# EAGLE design main_controller (EAGLE 7.6.0)
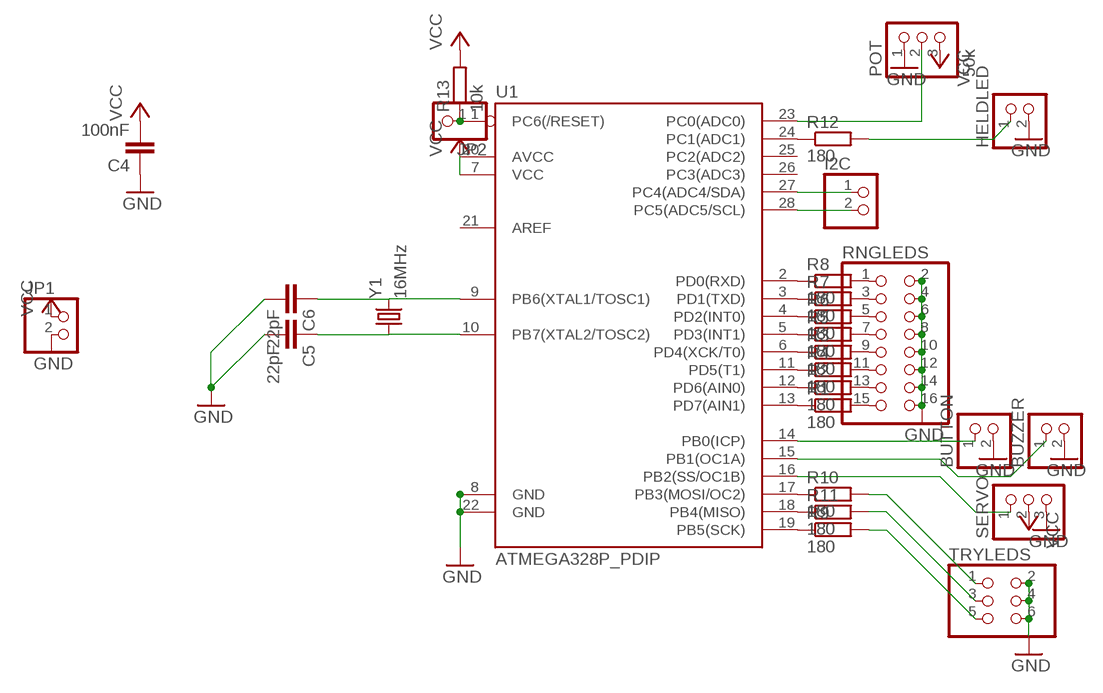
[diagram p0: schematic, sheet 1]

## Parts
BUTTON  PINHD-1X2  [1X02]
BUZZER  PINHD-1X2  [1X02]
C4  100nF  C-EU050-025X075  [C050-025X075]
C5  22pF  C-EU050-025X075  [C050-025X075]
C6  22pF  C-EU050-025X075  [C050-025X075]
HELDLED  PINHD-1X2  [1X02]
I2C  PINHD-1X2  [1X02]
JP1  PINHD-1X2  [1X02]
JP2  PINHD-1X1  [1X01]
POT  50k  PINHD-1X3  [1X03]
R1  180  R-EU_0207/7  [0207/7]
R2  180  R-EU_0207/7  [0207/7]
R3  180  R-EU_0207/7  [0207/7]
R4  180  R-EU_0207/7  [0207/7]
R5  180  R-EU_0207/7  [0207/7]
R6  180  R-EU_0207/7  [0207/7]
R7  180  R-EU_0207/7  [0207/7]
R8  180  R-EU_0207/7  [0207/7]
R9  180  R-EU_0207/7  [0207/7]
R10  180  R-EU_0207/7  [0207/7]
R11  180  R-EU_0207/7  [0207/7]
R12  180  R-EU_0207/7  [0207/7]
R13  10k  R-EU_0207/7  [0207/7]
RNGLEDS  PINHD-2X8  [2X08]
SERVO  PINHD-1X3  [1X03]
TRYLEDS  PINHD-2X3  [2X03]
U1  ATMEGA328P_PDIP  [DIL28-3]
Y1  16MHz  CRYSTALHC49US  [HC49US]

## Nets
GND: BUTTON.2 BUZZER.2 C4.1 C5.2 C6.2 HELDLED.2 JP1.2 POT.1 RNGLEDS.2 RNGLEDS.4 RNGLEDS.6 RNGLEDS.8 RNGLEDS.10 RNGLEDS.12 RNGLEDS.14 RNGLEDS.16 SERVO.3 TRYLEDS.2 TRYLEDS.4 TRYLEDS.6 U1.8(GND) U1.22(GND)
N$1: C6.1 U1.9(PB6(XTAL1/TOSC1)) Y1.2
N$2: C5.1 U1.10(PB7(XTAL2/TOSC2)) Y1.1
N$3: POT.2 U1.23(PC0(ADC0))
N$4: R12.1 U1.24(PC1(ADC1))
N$5: I2C.1 U1.27(PC4(ADC4/SDA))
N$6: I2C.2 U1.28(PC5(ADC5/SCL))
N$7: R1.1 U1.13(PD7(AIN1))
N$8: R2.1 U1.12(PD6(AIN0))
N$9: R3.1 U1.6(PD4(XCK/T0))
N$10: R4.1 U1.11(PD5(T1))
N$11: R5.1 U1.5(PD3(INT1))
N$12: R6.1 U1.4(PD2(INT0))
N$13: R7.1 U1.3(PD1(TXD))
N$14: R8.1 U1.2(PD0(RXD))
N$15: R1.2 RNGLEDS.15
N$16: R2.2 RNGLEDS.13
N$17: R3.2 RNGLEDS.9
N$18: R4.2 RNGLEDS.11
N$19: R5.2 RNGLEDS.7
N$20: R6.2 RNGLEDS.5
N$21: R7.2 RNGLEDS.3
N$22: R8.2 RNGLEDS.1
N$23: R9.1 U1.19(PB5(SCK))
N$24: R10.1 U1.17(PB3(MOSI/OC2))
N$25: R11.1 U1.18(PB4(MISO))
N$26: HELDLED.1 R12.2
N$27: R9.2 TRYLEDS.5
N$28: R11.2 TRYLEDS.3
N$29: R10.2 TRYLEDS.1
N$30: BUTTON.1 U1.14(PB0(ICP))
N$31: BUZZER.1 U1.15(PB1(OC1A))
N$32: SERVO.1 U1.16(PB2(SS/OC1B))
N$33: JP2.1 R13.1 U1.1(PC6(/RESET))
VCC: C4.2 JP1.1 POT.3 R13.2 SERVO.2 U1.7(VCC) U1.20(AVCC)
Unconnected: U1.21(AREF) U1.25(PC2(ADC2)) U1.26(PC3(ADC3))

## Library data of the parts
BUTTON BUZZER HELDLED I2C JP1 = pinhead:PINHD-1X2: PIN HEADER
C4-C6 = resistor:C-EU: CAPACITOR, European symbol
JP2 = pinhead:PINHD-1X1: PIN HEADER
POT SERVO = pinhead:PINHD-1X3: PIN HEADER
R1-R13 = resistor:R-EU_: RESISTOR, European symbol
RNGLEDS = pinhead:PINHD-2X8: PIN HEADER
TRYLEDS = pinhead:PINHD-2X3: PIN HEADER
U1 = SparkFun-DigitalIC:ATMEGA328P_PDIP: uC used in the Arduino 32kb flash, 1k EEPROM, 2k SRAM This is the through-hole version of this chip.
Y1 = SparkFun-FreqCtrl:CRYSTAL: Various standard crystals. Proven footprints.

## Board
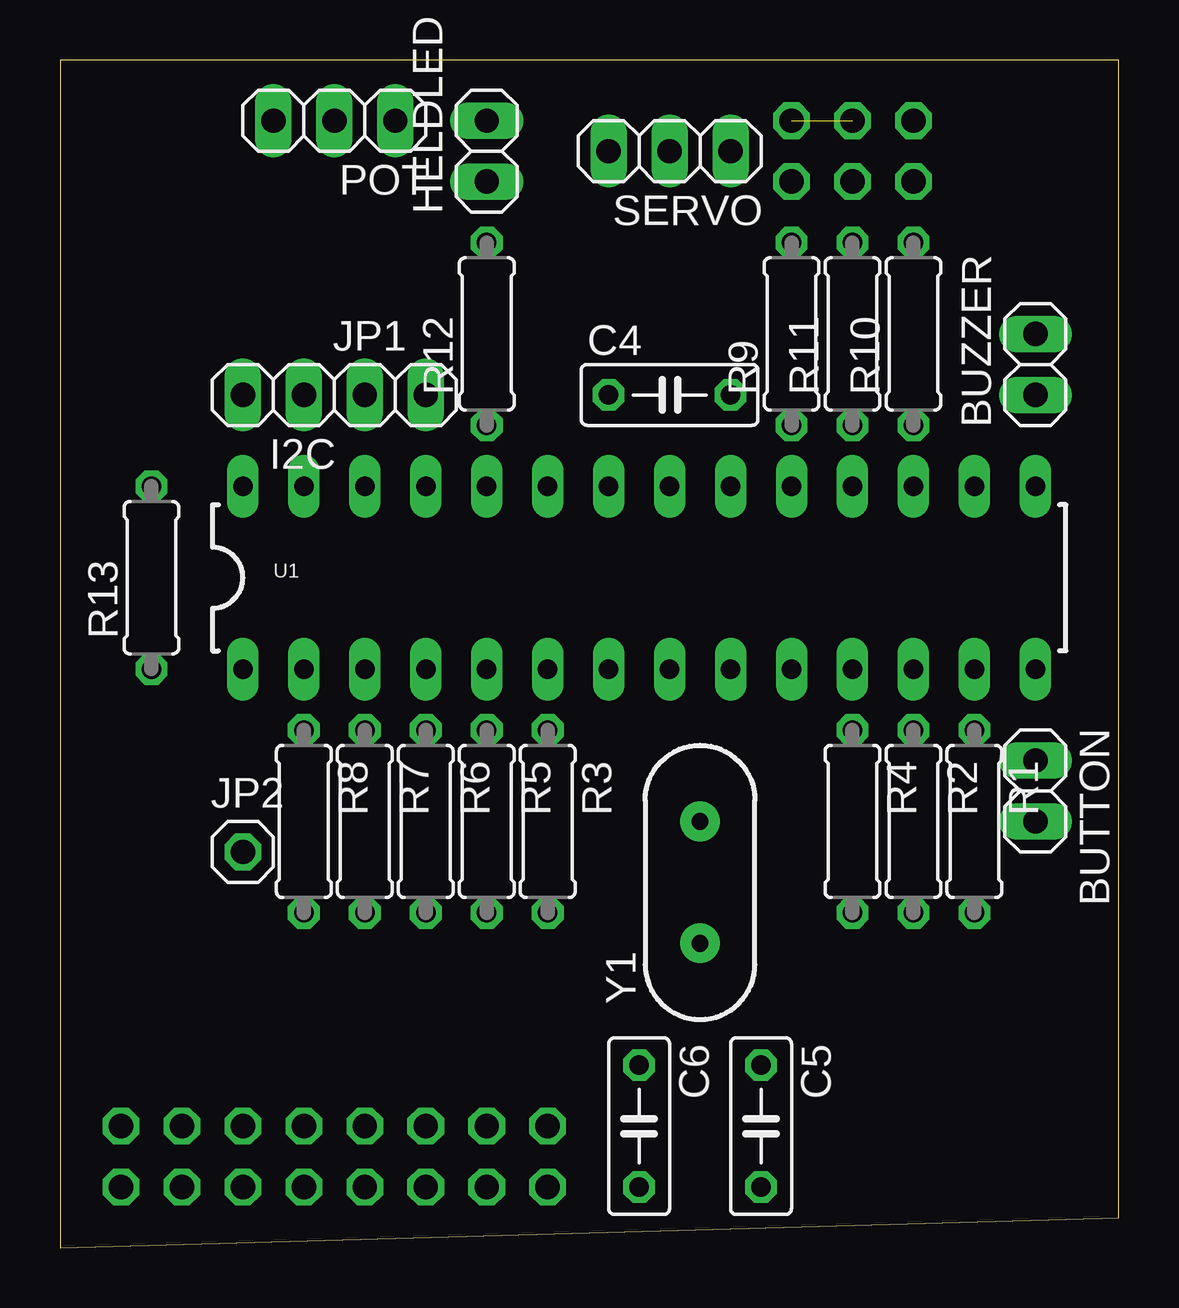
[diagram p1: board, top side]
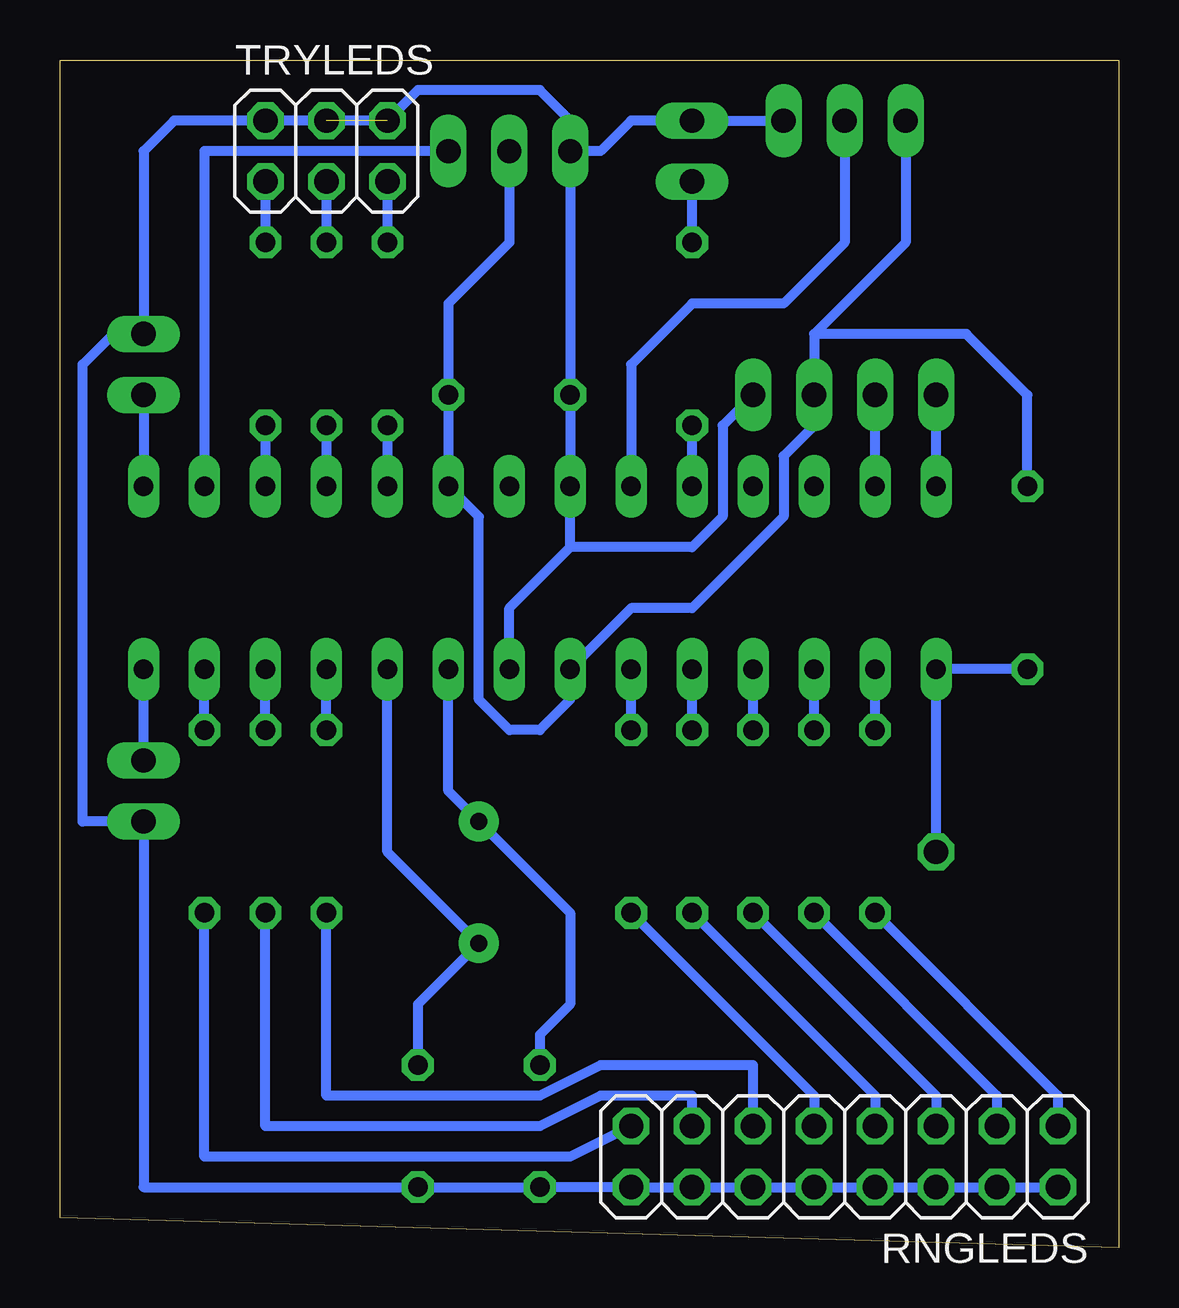
[diagram p2: board, bottom side, seen from below]

Size 44.12 x 49.52 mm. Coordinates in mm from the lower left corner, seen from the top.
Outline: 0,0 44.12,1.27 44.12,49.52 0,49.52 0,0
Copper layers (1*16): Top 0.035mm / dielectric 1.5mm / Bottom 0.035mm
Design rules "default": minimum track width 10mil, minimum drill 24mil, track to track 8mil, track to pad 8mil, pad to pad 8mil, via to via 8mil, smd to smd 8mil, copper to edge 40mil, drill to drill 8mil, minimum pad ring 10mil, minimum via ring 8mil, stop-mask expansion 4mil, vias tented up to drill 0mil, thermal gap 10mil

### Footprints (pad centres in the part's own frame; a part is rotated, then mirrored left to right if it is on the bottom)
1X02 = drill 1.016 long: 1 -1.27,0; 2 1.27,0
C050-025X075 = drill 0.813 octagon: 1 -2.54,0; 2 2.54,0
1X01 = drill 1.016 octagon: 1 0,0
1X03 = drill 1.016 long: 1 -2.54,0; 2 0,0; 3 2.54,0
0207/7 = drill 0.813 octagon: 1 -3.81,0; 2 3.81,0
2X08 = drill 1.016 octagon: 1 -8.89,-1.27; 2 -8.89,1.27; 3 -6.35,-1.27; 4 -6.35,1.27; 5 -3.81,-1.27; 6 -3.81,1.27; 7 -1.27,-1.27; 8 -1.27,1.27; 9 1.27,-1.27; 10 1.27,1.27; 11 3.81,-1.27; 12 3.81,1.27; 13 6.35,-1.27; 14 6.35,1.27; 15 8.89,-1.27; 16 8.89,1.27
2X03 = drill 1.016 octagon: 1 -2.54,-1.27; 2 -2.54,1.27; 3 0,-1.27; 4 0,1.27; 5 2.54,-1.27; 6 2.54,1.27
DIL28-3 = drill 0.813 long: 1 -16.51,-3.81; 2 -13.97,-3.81; 3 -11.43,-3.81; 4 -8.89,-3.81; 5 -6.35,-3.81; 6 -3.81,-3.81; 7 -1.27,-3.81; 8 1.27,-3.81; 9 3.81,-3.81; 10 6.35,-3.81; 11 8.89,-3.81; 12 11.43,-3.81; 13 13.97,-3.81; 14 16.51,-3.81; 15 16.51,3.81; 16 13.97,3.81; 17 11.43,3.81; 18 8.89,3.81; 19 6.35,3.81; 20 3.81,3.81; 21 1.27,3.81; 22 -1.27,3.81; 23 -3.81,3.81; 24 -6.35,3.81; 25 -8.89,3.81; 26 -11.43,3.81; 27 -13.97,3.81; 28 -16.51,3.81
HC49US = drill 0.7 pad 1.651: 1 -2.54,0; 2 2.54,0

### Placement (x,y rotation side)
BUTTON  40.64,19.05 270 top
BUZZER  40.64,36.83 90 top
C4  25.4,35.56 0 top
C5  29.21,5.08 270 top
C6  24.13,5.08 270 top
HELDLED  17.78,45.72 90 top
I2C  8.89,35.56 180 top
JP1  13.97,35.56 0 top
JP2  7.62,16.51 0 top
POT  11.43,46.99 180 top
R1  38.1,17.78 270 top
R2  35.56,17.78 270 top
R3  20.32,17.78 270 top
R4  33.02,17.78 270 top
R5  17.78,17.78 270 top
R6  15.24,17.78 270 top
R7  12.7,17.78 270 top
R8  10.16,17.78 270 top
R9  30.48,38.1 90 top
R10  35.56,38.1 90 top
R11  33.02,38.1 90 top
R12  17.78,38.1 90 top
R13  3.81,27.94 90 top
RNGLEDS  11.43,3.81 180 bottom
SERVO  25.4,45.72 180 top
TRYLEDS  33.02,45.72 0 bottom
U1  24.13,27.94 0 top
Y1  26.67,15.24 90 top

### Tracks (layer width: path | path; a pad name or v marks a point on that pad's centre or on a via)
GND  (1 unrouted)
  Bottom 0.406: U1.8 25.4,26.67 22.86,29.21 | 22.86,29.21 U1.22 C4.1 SERVO.3 | RNGLEDS.2 RNGLEDS.4 RNGLEDS.6 RNGLEDS.8 RNGLEDS.10 RNGLEDS.12 RNGLEDS.14 RNGLEDS.16 C6.2 C5.2 40.64,2.54 BUTTON.2 43.18,17.78 43.18,36.83 41.91,38.1 BUZZER.2 40.64,45.72 39.37,46.99 TRYLEDS.2 TRYLEDS.6 29.21,48.26 24.13,48.26 22.86,46.99 SERVO.3 | SERVO.3 21.59,45.72 20.32,46.99 HELDLED.2 POT.1 | JP1.2 16.51,34.29 16.51,30.48 17.78,29.21 22.86,29.21
N$1
  Bottom 0.406: U1.9 27.94,19.05 Y1.2 22.86,13.97 22.86,10.16 24.13,8.89 C6.1
N$2
  Bottom 0.406: U1.10 30.48,16.51 Y1.1 29.21,10.16 C5.1
N$3
  Bottom 0.406: POT.2 11.43,41.91 13.97,39.37 17.78,39.37 20.32,36.83 U1.23
N$4
  Bottom 0.406: U1.24 R12.1
N$5
  Bottom 0.406: U1.27 I2C.1
N$6
  Bottom 0.406: U1.28 I2C.2
N$7
  Bottom 0.406: R1.1 U1.13
N$8
  Bottom 0.406: R2.1 U1.12
N$9
  Bottom 0.406: R3.1 U1.6
N$10
  Bottom 0.406: R4.1 U1.11
N$11
  Bottom 0.406: R5.1 U1.5
N$12
  Bottom 0.406: R6.1 U1.4
N$13
  Bottom 0.406: R7.1 U1.3
N$14
  Bottom 0.406: R8.1 U1.2
N$15
  Bottom 0.406: RNGLEDS.15 22.86,3.81 38.1,3.81 R1.2
N$16
  Bottom 0.406: RNGLEDS.13 17.78,6.35 21.59,6.35 24.13,5.08 35.56,5.08 R2.2
N$17
  Bottom 0.406: R3.2 12.7,6.35 RNGLEDS.9
N$18
  Bottom 0.406: RNGLEDS.11 15.24,7.62 21.59,7.62 24.13,6.35 33.02,6.35 R4.2
N$19
  Bottom 0.406: R5.2 10.16,6.35 RNGLEDS.7
N$20
  Bottom 0.406: R6.2 7.62,6.35 RNGLEDS.5
N$21
  Bottom 0.406: R7.2 5.08,6.35 RNGLEDS.3
N$22
  Bottom 0.406: R8.2 2.54,6.35 RNGLEDS.1
N$23
  Bottom 0.406: R9.1 U1.19
N$24
  Bottom 0.406: R10.1 U1.17
N$25
  Bottom 0.406: R11.1 U1.18
N$26
  Bottom 0.406: R12.2 HELDLED.1
N$27
  Bottom 0.406: TRYLEDS.5 R9.2
N$28
  Bottom 0.406: TRYLEDS.3 R11.2
N$29
  Bottom 0.406: TRYLEDS.1 R10.2
N$30
  Bottom 0.406: BUTTON.1 U1.14
N$31
  Bottom 0.406: BUZZER.1 U1.15
N$32
  Bottom 0.406: SERVO.1 38.1,45.72 U1.16
N$33
  Bottom 0.406: R13.1 U1.1 JP2.1
VCC
  Bottom 0.406: SERVO.2 25.4,41.91 27.94,39.37 C4.2 U1.20 26.67,30.48 26.67,22.86 25.4,21.59 24.13,21.59 22.86,22.86 U1.7 20.32,26.67 17.78,26.67 13.97,30.48 13.97,33.02 12.7,34.29 JP1.1 12.7,38.1 | POT.3 8.89,41.91 12.7,38.1 | R13.2 3.81,35.56 6.35,38.1 12.7,38.1